# EasyEDA schematic Receiver_schematic.json
TITLE: Sheet_1; REV: 1.0; Date: 2026-03-24; Sheet: 1/1; Drawn By: bimsaraliyanawaththage24; Company: Your Company
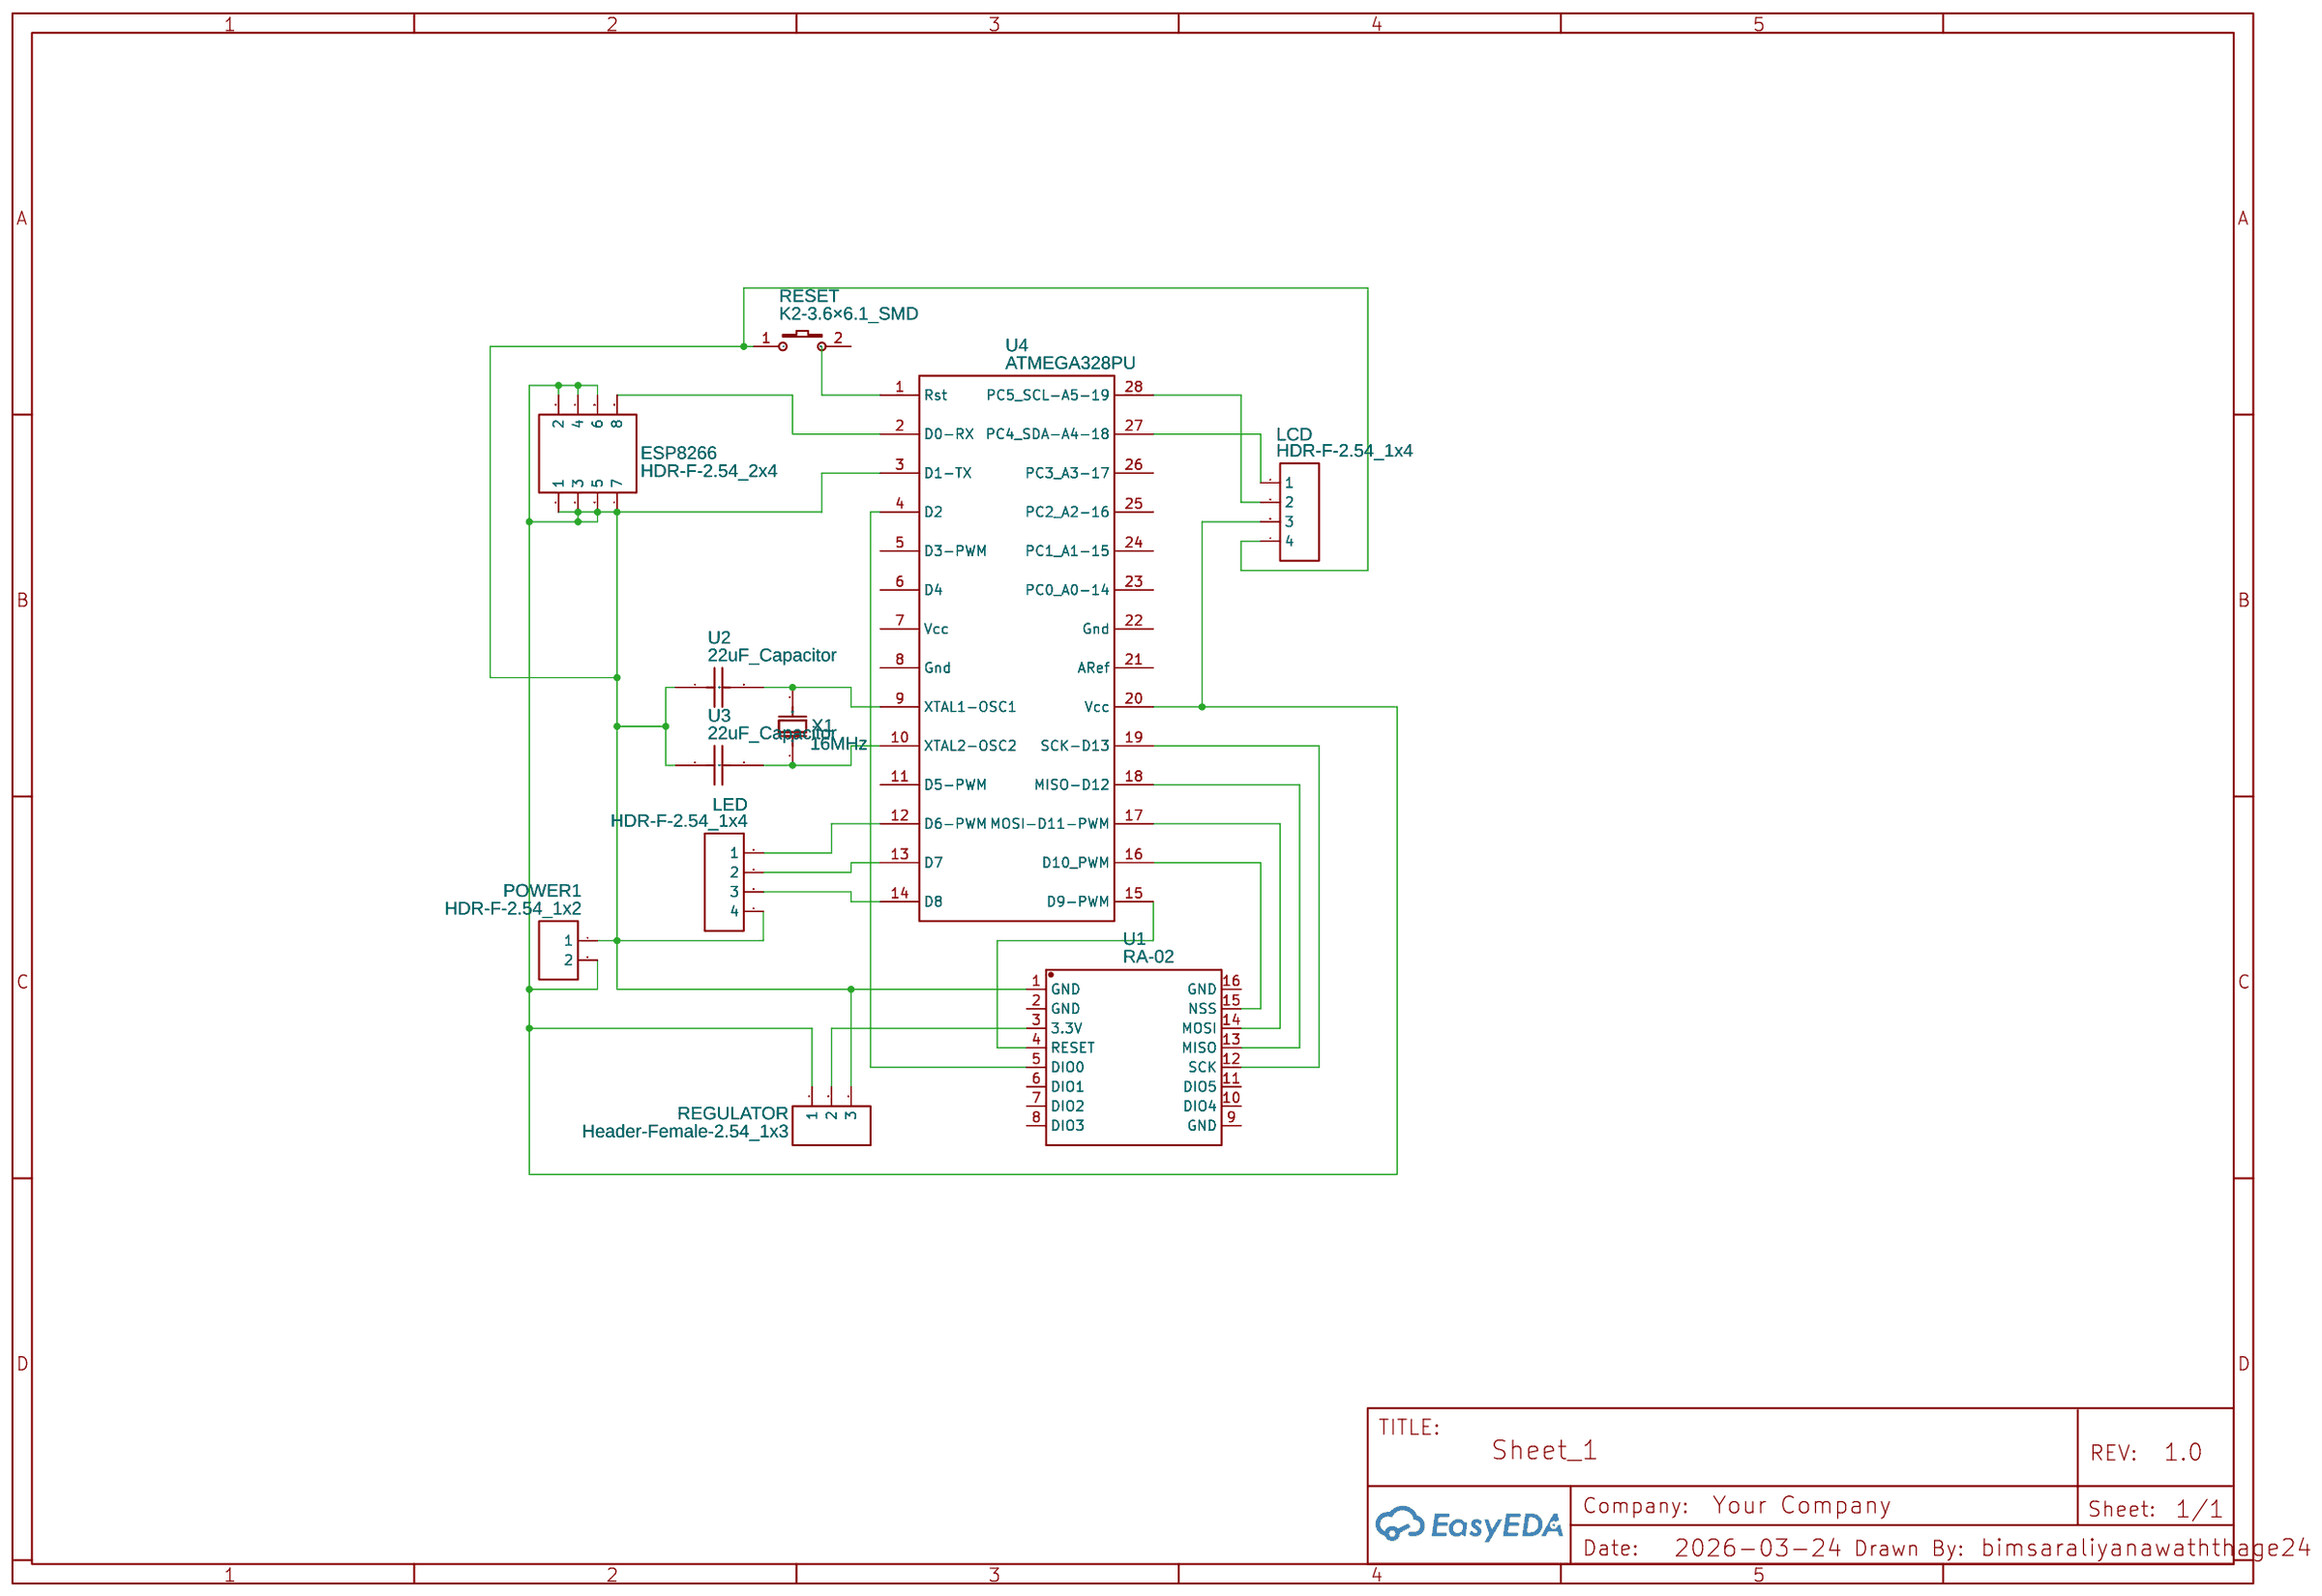
[diagram p0: schematic sheet]

## Parts
ESP8266  HDR-F-2.54_2x4  [HDR-F-2.54_2X4]
LCD  HDR-F-2.54_1x4  [HDR-F-2.54_1X4]
LED  HDR-F-2.54_1x4  [HDR-F-2.54_1X4]
POWER1  HDR-F-2.54_1x2  [HDR-F-2.54_1X2]
REGULATOR  Header-Female-2.54_1x3  [HDR-TH_3P-P2.54-V-F]
RESET  K2-3.6×6.1_SMD  [KEY-SMD_2P-L6.2-W3.6-LS8.0]
U1  RA-02  [WIRELM-SMD_RA-02-BL]
U2  22uF_Capacitor  [SAMSUNG-22UF-CAPACITOR]
U3  22uF_Capacitor  [SAMSUNG-22UF-CAPACITOR]
U4  ATMEGA328PU  [ATMEGA328PU]
X1  16MHz  [CRISTAL_16MHZ]

## Library data of the parts
ESP8266 = HDR-F-2.54_2x4: Supplier Part: C239344; Supplier: LCSC; Contributor: LCEDA_Lib
LCD LED = HDR-F-2.54_1x4: Supplier Part: C225501; Supplier: LCSC; Contributor: LCEDA_Lib
POWER1 = HDR-F-2.54_1x2: Supplier Part: C49661; Supplier: LCSC; Contributor: LCEDA_Lib
REGULATOR = Header-Female-2.54_1x3: Supplier Part: C146243; Supplier: LCSC; Manufacturer: BOOMELE(博穆精密); Manufacturer Part: 2.54-1*3P母; JLCPCB Part Class: Extended Part
RESET = K2-3.6×6.1_SMD: Supplier Part: C118141; Supplier: LCSC; Manufacturer Part: K2-1107ST-A4SW-06; Contributor: LCEDA_Lib; 制造商: 韩国韩荣
U1 = RA-02: Contributor: LCSC; Supplier: LCSC; Supplier Part: C90039; Manufacturer: Ai-Thinker(安信可); Manufacturer Part: Ra-02; JLCPCB Part Class: Extended Part
U2 U3 = 22uF_Capacitor: Contributor: cwd.ngpi
U4 = ATMEGA328PU: Contributor: gmorson
X1 = CRISTAL_16MHZ: Supplier Part: 2819276; Supplier: Element14; Manufacturer: TXC; Manufacturer Part: 9B-48.000MAAE-B; Contributor: Ramsha

## Nets
Net-(ESP8266-1): ESP8266.1 ESP8266.2 ESP8266.3 ESP8266.4 ESP8266.5 ESP8266.6 ESP8266.7 LCD.3 LCD.4 LED.4 POWER1.1 POWER1.2 REGULATOR.1 REGULATOR.3 RESET.1 U1.1(GND) U2.1 U3.1 U4.3(D1-TX) U4.20(Vcc)
Net-(ESP8266-8): ESP8266.8 U4.2(D0-RX)
Net-(LCD-1): LCD.1 U4.27(PC4 SDA-A4-18)
Net-(LCD-2): LCD.2 U4.28(PC5 SCL-A5-19)
Net-(LED-1): LED.1 U4.12(D6-PWM)
Net-(LED-2): LED.2 U4.13(D7)
Net-(LED-3): LED.3 U4.14(D8)
Net-(REGULATOR-2): REGULATOR.2 U1.3(3.3V)
Net-(U1-4): U1.4(RESET) U4.15(D9-PWM)
Net-(U1-5): U1.5(DIO0) U4.4(D2)
Net-(U1-12): U1.12(SCK) U4.19(SCK-D13)
Net-(U1-13): U1.13(MISO) U4.18(MISO-D12)
Net-(U1-14): U1.14(MOSI) U4.17(MOSI-D11-PWM)
Net-(U1-15): U1.15(NSS) U4.16(D10 PWM)
Net-(U2-2): U2.2 U4.9(XTAL1-OSC1) X1.2(OSC2)
Net-(U3-2): U3.2 U4.10(XTAL2-OSC2) X1.1(OSC1)

Not connected (* = marked no-connect by the designer): RESET 2; U1 2(GND) 6(DIO1) 7(DIO2) 8(DIO3) 9(GND) 10(DIO4) 11(DIO5) 16(GND); U4 1(Rst) 5(D3-PWM) 6(D4) 7(Vcc) 8(Gnd) 11(D5-PWM) 21(ARef) 22(Gnd) 23(PC0 A0-14) 24(PC1 A1-15) 25(PC2 A2-16) 26(PC3 A3-17)
